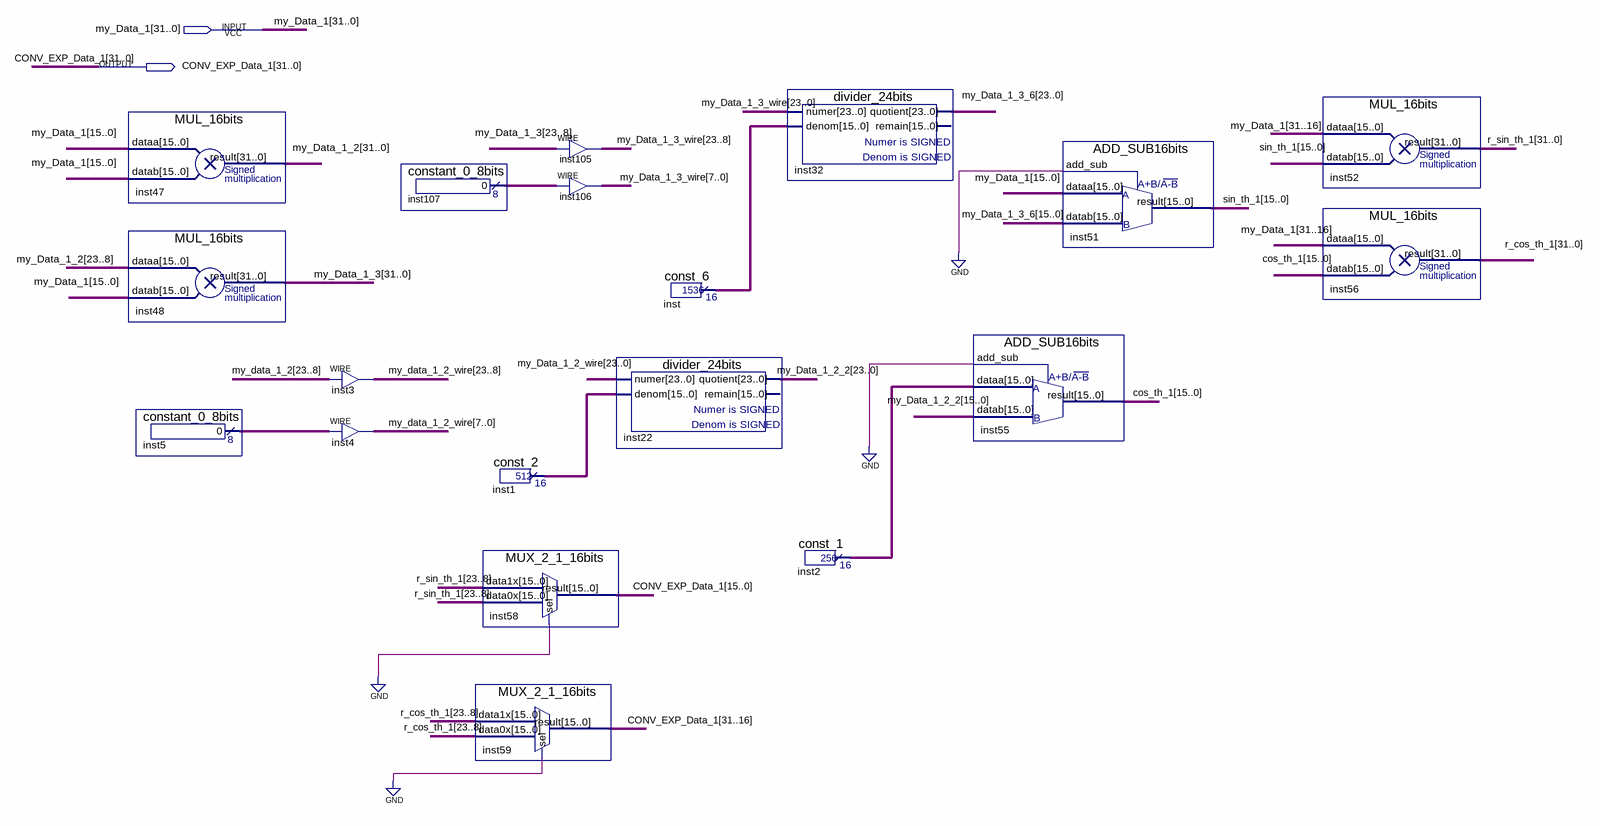
[diagram p0: schematic sheet]
// Quartus schematic pf_to_exp_converter.bdf as structural Verilog: 19 symbols, 2 pins
module pf_to_exp_converter (
  input  [31:0] my_Data_1,
  output [31:0] CONV_EXP_Data_1
);

  wire [7:0] inst5_result, inst107_result;
  wire [15:0] cos_th_1, inst1_result, inst2_result, inst_result, sin_th_1;
  wire [23:0] my_Data_1_2_2, my_Data_1_2_wire, my_Data_1_3_6, my_Data_1_3_wire;
  wire [31:0] my_Data_1_2, my_Data_1_3, r_cos_th_1, r_sin_th_1;

  MUL_16bits inst47 (.dataa(my_Data_1[15:0]), .datab(my_Data_1[15:0]), .result(my_Data_1_2));
  MUL_16bits inst48 (.dataa(my_Data_1_2[23:8]), .datab(my_Data_1[15:0]), .result(my_Data_1_3));
  constant_0_8bits inst5 (.result(inst5_result));
  assign my_Data_1_2_wire[23:8] = my_Data_1_2[23:8];  // WIRE inst3
  assign my_Data_1_2_wire[7:0] = inst5_result;  // WIRE inst4
  constant_0_8bits inst107 (.result(inst107_result));
  const_2 inst1 (.result(inst1_result));
  MUX_2_1_16bits inst58 (
    .data1x(r_sin_th_1[23:8]), .data0x(r_sin_th_1[23:8]), .sel(1'b0), .result(CONV_EXP_Data_1[15:0]));
  MUX_2_1_16bits inst59 (
    .data1x(r_cos_th_1[23:8]), .data0x(r_cos_th_1[23:8]), .sel(1'b0), .result(CONV_EXP_Data_1[31:16]));
  assign my_Data_1_3_wire[23:8] = my_Data_1_3[23:8];  // WIRE inst105
  assign my_Data_1_3_wire[7:0] = inst107_result;  // WIRE inst106
  divider_24bits inst22 (.numer(my_Data_1_2_wire), .denom(inst1_result), .quotient(my_Data_1_2_2));  // open: remain
  const_6 inst (.result(inst_result));
  divider_24bits inst32 (.numer(my_Data_1_3_wire), .denom(inst_result), .quotient(my_Data_1_3_6));  // open: remain
  const_1 inst2 (.result(inst2_result));
  ADD_SUB16bits inst55 (.add_sub(1'b0), .dataa(inst2_result), .datab(my_Data_1_2_2[15:0]), .result(cos_th_1));
  ADD_SUB16bits inst51 (.add_sub(1'b0), .dataa(my_Data_1[15:0]), .datab(my_Data_1_3_6[15:0]), .result(sin_th_1));
  MUL_16bits inst52 (.dataa(my_Data_1[31:16]), .datab(sin_th_1), .result(r_sin_th_1));
  MUL_16bits inst56 (.dataa(my_Data_1[31:16]), .datab(cos_th_1), .result(r_cos_th_1));
endmodule
